# EAGLE board MSV-back (EAGLE 9.5.2)
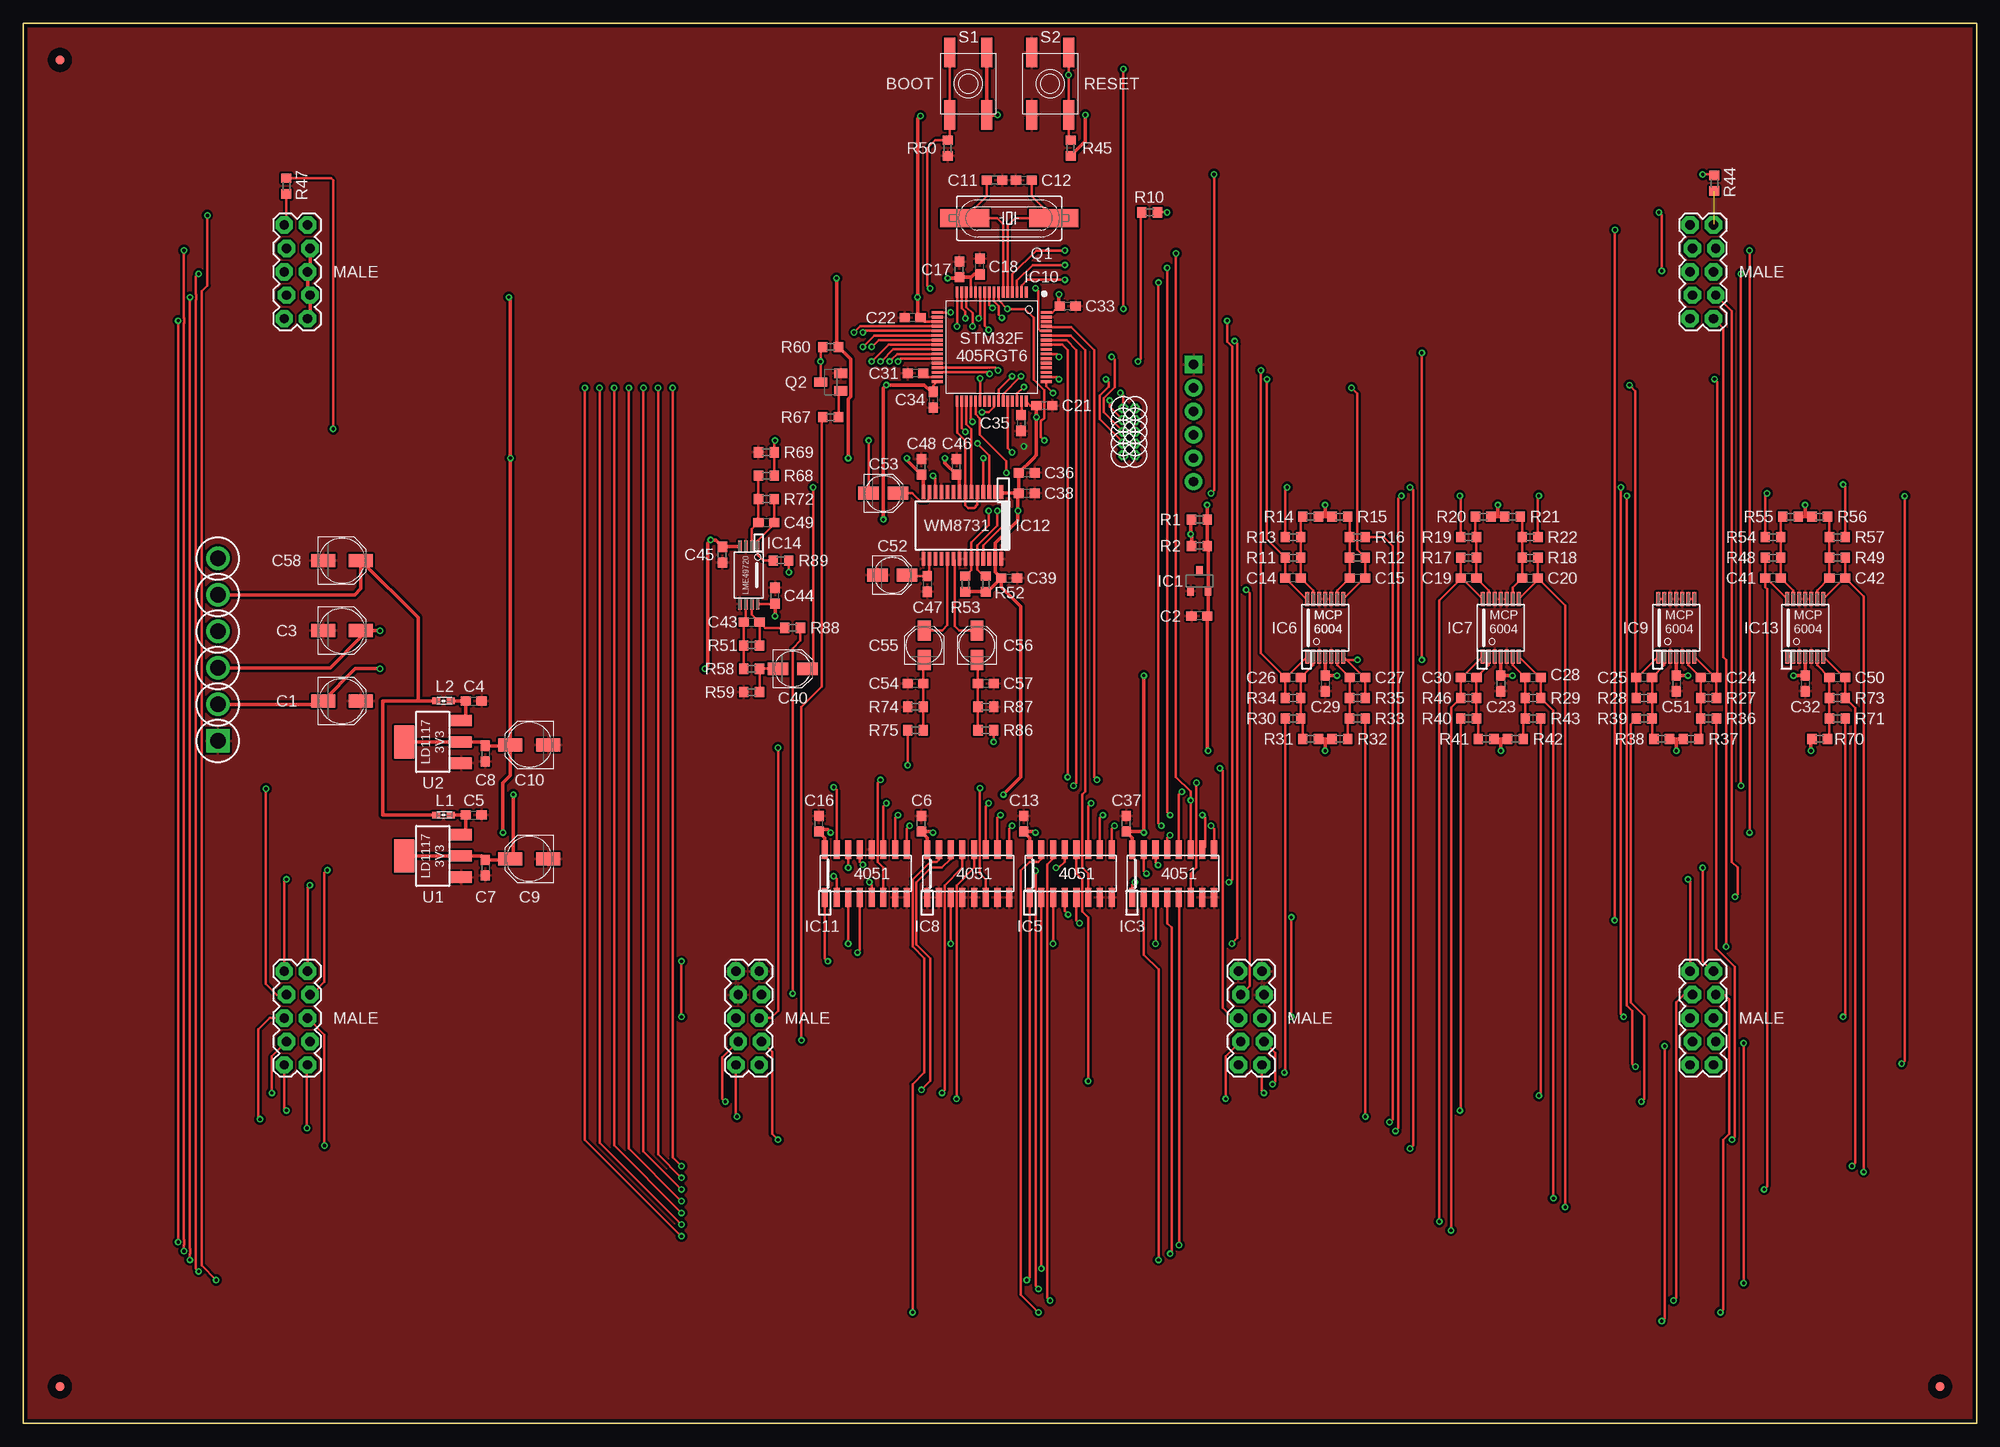
[diagram p5: board, top side]
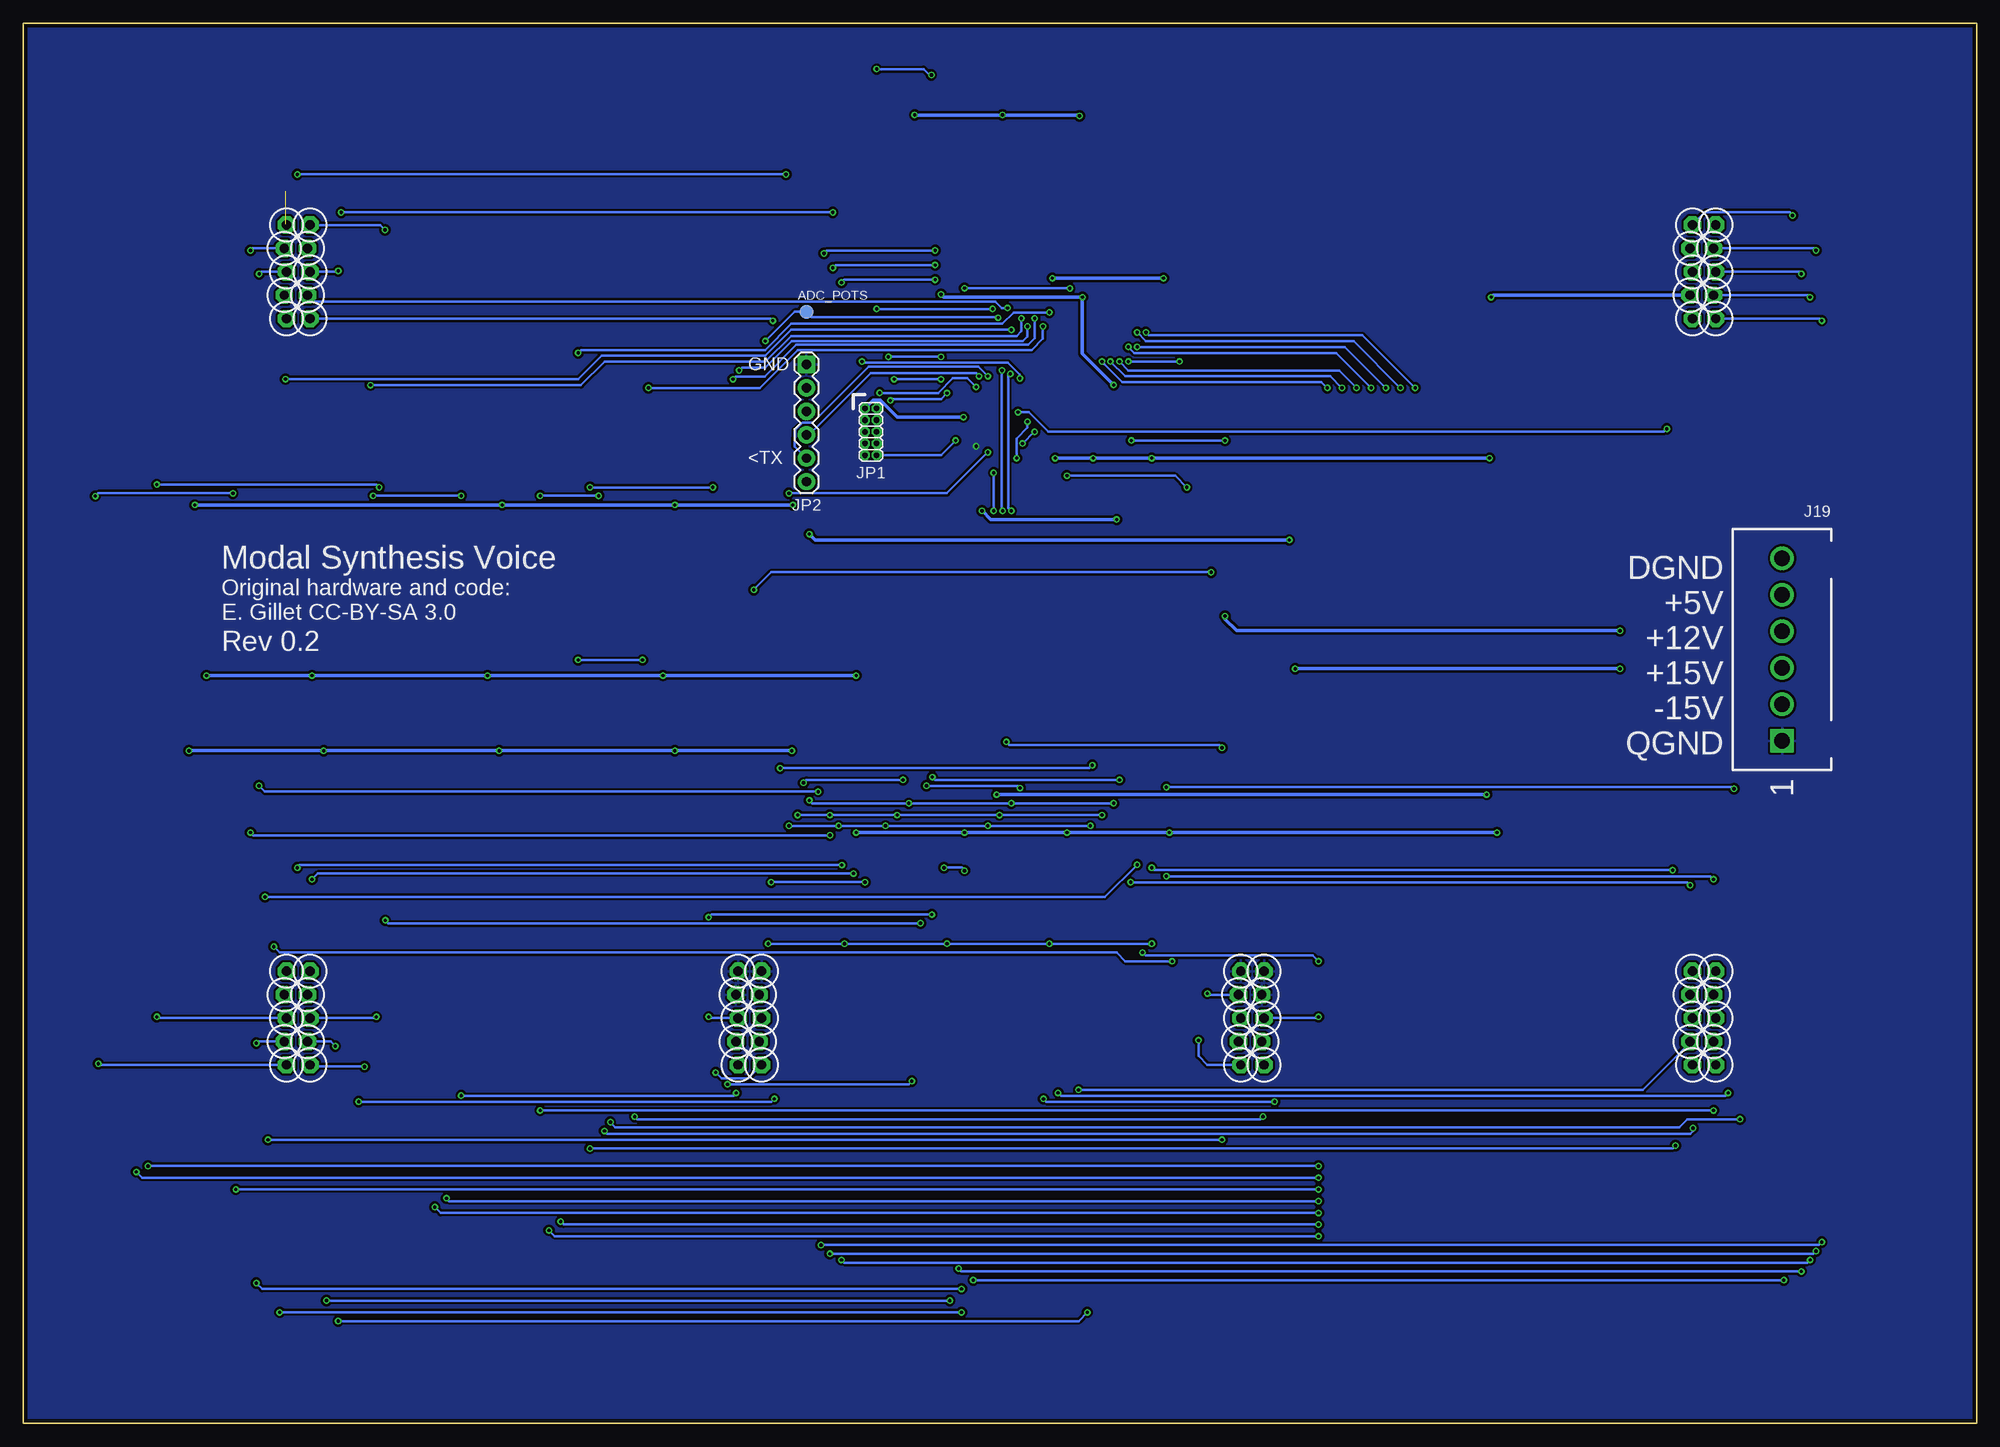
[diagram p6: board, bottom side, seen from below]

Size 212 x 152 mm. Coordinates in mm from the lower left corner, seen from the top.
Outline: 0,0 212,0 212,152 0,152 0,0
Copper layers (1*16): Top 0.0356mm / dielectric 1.5011mm / Bottom 0.0356mm
Design rules "ES_DRC_MaskedVias": minimum track width 6mil, minimum drill 13mil, track to track 6mil, track to pad 6mil, pad to pad 6mil, via to via 6mil, smd to smd 6mil, copper to edge 15mil, drill to drill 6mil, minimum pad ring 7mil, minimum via ring 7mil, stop-mask expansion 3mil, vias tented up to drill 16mil, thermal gap 10mil
Net classes: 0 default: width 0.203 mm

## Footprints (pad centres in the part's own frame; a part is rotated, then mirrored left to right if it is on the bottom)
PANASONIC_C = smd 2.6 x 1.4: + 2.05,0; - -2.05,0
C0603 = smd 1.1 x 1: 1 -0.85,0; 2 0.85,0
PANASONIC_B = smd 2.2 x 1.4: + 1.6,0; - -1.6,0
FIDUCIAL_1MM = smd 1 x 1: 1 0,0
DBZ_R-PDSO-G3 = smd 0.7 x 1: 1 -0.95,-1.1; 2 0.95,-1.1; 3 0,1.1
SO-16 = smd 0.66 x 2.032: 1 -4.445,-2.591; 2 -3.175,-2.591; 3 -1.905,-2.591; 4 -0.635,-2.591; 5 0.635,-2.591; 6 1.905,-2.591; 7 3.175,-2.591; 8 4.445,-2.591; 9 4.445,2.591; 10 3.175,2.591; 11 1.905,2.591; 12 0.635,2.591; 13 -0.635,2.591; 14 -1.905,2.591; 15 -3.175,2.591; 16 -4.445,2.591
TSSOP-14 = smd 0.45 x 1.5: 1 -1.95,-3.117; 2 -1.3,-3.117; 3 -0.65,-3.117; 4 0,-3.117; 5 0.65,-3.117; 6 1.3,-3.117; 7 1.95,-3.117; 8 1.95,3.117; 9 1.3,3.117; 10 0.65,3.117; 11 0,3.117; 12 -0.65,3.117; 13 -1.3,3.117; 14 -1.95,3.117
TQFP-10X10-64 = smd 1.2 x 0.3: 1 -5.936,3.75; 2 -5.936,3.25; 3 -5.936,2.75; 4 -5.936,2.25; 5 -5.936,1.75; 6 -5.936,1.25; 7 -5.936,0.75; 8 -5.936,0.25; 9 -5.936,-0.25; 10 -5.936,-0.75; 11 -5.936,-1.25; 12 -5.936,-1.75; 13 -5.936,-2.25; 14 -5.936,-2.75; 15 -5.936,-3.25; 16 -5.936,-3.75; 33 5.886,-3.75; 34 5.886,-3.25; 35 5.886,-2.75; 36 5.886,-2.25; 37 5.886,-1.75; 38 5.886,-1.25; 39 5.886,-0.75; 40 5.886,-0.25; 41 5.886,0.25; 42 5.886,0.75; 43 5.886,1.25; 44 5.886,1.75; 45 5.886,2.25; 46 5.886,2.75; 47 5.886,3.25; 48 5.886,3.75 | smd 0.3 x 1.2: 17 -3.75,-5.911; 18 -3.25,-5.911; 19 -2.75,-5.911; 20 -2.25,-5.911; 21 -1.75,-5.911; 22 -1.25,-5.911; 23 -0.75,-5.911; 24 -0.25,-5.911; 25 0.25,-5.911; 26 0.75,-5.911; 27 1.25,-5.911; 28 1.75,-5.911; 29 2.25,-5.911; 30 2.75,-5.911; 31 3.25,-5.911; 32 3.75,-5.911; 49 3.75,5.936; 50 3.25,5.936; 51 2.75,5.936; 52 2.25,5.936; 53 1.75,5.936; 54 1.25,5.936; 55 0.75,5.936; 56 0.25,5.936; 57 -0.25,5.936; 58 -0.75,5.936; 59 -1.25,5.936; 60 -1.75,5.936; 61 -2.25,5.936; 62 -2.75,5.936; 63 -3.25,5.936; 64 -3.75,5.936
SSOP-28 = smd 0.4 x 1.5: 1 -4.225,-3.625; 2 -3.575,-3.625; 3 -2.925,-3.625; 4 -2.275,-3.625; 5 -1.625,-3.625; 6 -0.975,-3.625; 7 -0.325,-3.625; 8 0.325,-3.625; 9 0.975,-3.625; 10 1.625,-3.625; 11 2.275,-3.625; 12 2.925,-3.625; 13 3.575,-3.625; 14 4.225,-3.625; 15 4.225,3.625; 16 3.575,3.625; 17 2.925,3.625; 18 2.275,3.625; 19 1.625,3.625; 20 0.975,3.625; 21 0.325,3.625; 22 -0.325,3.625; 23 -0.975,3.625; 24 -1.625,3.625; 25 -2.275,3.625; 26 -2.925,3.625; 27 -3.575,3.625; 28 -4.225,3.625
TSSOP-8 = smd 0.35 x 1.27: 1 -0.99,-3.117; 2 -0.34,-3.117; 3 0.31,-3.117; 4 0.96,-3.117; 5 0.96,3.117; 6 0.31,3.117; 7 -0.34,3.117; 8 -0.99,3.117
MTA_156 = drill 1.7 square: 1 -9.9,0 | drill 1.7: 2 -5.94,0; 3 -1.98,0; 4 1.98,0; 5 5.94,0; 6 9.9,0
2X5-1.27 = drill 0.61 pad 1.067 octagon: 1 -1.27,3.81; 2 0,3.81; 3 -1.27,2.54; 4 0,2.54; 5 -1.27,1.27; 6 0,1.27; 7 -1.27,0; 8 0,0; 9 -1.27,-1.27; 10 0,-1.27
1X06_SQUARE = drill 1.016 pad 1.88 square: 1 0,0 | drill 1.016 pad 1.88: 2 2.54,0; 3 5.08,0; 4 7.62,0; 5 10.16,0; 6 12.7,0
WUERTH-ELEKTRONIK_0603 = smd 0.85 x 0.7: 1 -0.9,0; 2 0.7,0
2X5_LOCK_MALE = drill 1.016 pad 1.88 octagon: 1 -1.397,5.08; 2 1.143,5.08; 3 -1.143,2.54; 4 1.397,2.54; 5 -1.397,0; 6 1.143,0; 7 -1.143,-2.54; 8 1.397,-2.54; 9 -1.397,-5.08; 10 1.143,-5.08
HC49UP = smd 5.334 x 1.93: 1 -4.826,0; 2 4.826,0
SOT23-BEC = smd 1 x 1.4: B -0.95,-1.1; C 0,1.1; E 0.95,-1.1
R0603 = smd 1 x 1.1: 1 -0.85,0; 2 0.85,0
EVQ-Q2 = smd 3.2 x 1.2: A -3.4,-2; A' 3.4,-2; B -3.4,2; B' 3.4,2
TP15R = smd 1.5 x 1.5: TP 0,0
SOT223 = smd 2.235 x 1.219: 1 3.099,-2.311; 2 3.099,0; 3 3.099,2.311 | smd 2.2 x 3.6: TAB -3.099,0

## Placement (x,y rotation side)
C1  22UF  [PANASONIC_C]  34.61,78.42 0 top
C2  100NF  [C0603]  127.64,87.63 180 top
C3  22UF  [PANASONIC_C]  34.61,86.04 0 top
C4  100NF  [C0603]  48.9,78.42 0 top
C5  100NF  [C0603]  48.9,66.04 0 top
C6  100NF  [C0603]  97.47,65.09 90 top
C7  100NF  [C0603]  50.16,60.33 270 top
C8  100NF  [C0603]  50.16,72.71 270 top
C9  22UF  [PANASONIC_C]  54.93,61.28 180 top
C10  22UF  [PANASONIC_C]  54.93,73.66 180 top
C11  18PF  [C0603]  105.41,134.94 180 top
C12  18PF  [C0603]  108.58,134.94 0 top
C13  100NF  [C0603]  108.58,65.09 90 top
C14  3.3NF  [C0603]  137.79,91.76 180 top
C15  3.3NF  [C0603]  144.78,91.76 0 top
C16  100NF  [C0603]  86.36,65.09 90 top
C17  1UF  [C0603]  101.6,125.25 90 top
C18  100NF  [C0603]  103.82,125.57 90 top
C19  3.3NF  [C0603]  156.84,91.76 180 top
C20  3.3NF  [C0603]  163.51,91.76 0 top
C21  100NF  [C0603]  110.81,110.49 0 top
C22  100NF  [C0603]  96.52,120.02 180 top
C23  100NF  [C0603]  160.34,80.33 270 top
C24  3.3NF  [C0603]  182.88,80.96 0 top
C25  3.3NF  [C0603]  175.9,80.96 180 top
C26  3.3NF  [C0603]  137.79,80.96 180 top
C27  3.3NF  [C0603]  144.78,80.96 0 top
C28  3.3NF  [C0603]  163.83,80.96 0 top
C29  100NF  [C0603]  141.29,80.33 270 top
C30  3.3NF  [C0603]  156.84,80.96 180 top
C31  2.2UF  [C0603]  96.84,113.98 180 top
C32  100NF  [C0603]  193.36,80.33 270 top
C33  100NF  [C0603]  113.35,121.28 0 top
C34  100NF  [C0603]  98.74,111.12 270 top
C35  2.2UF  [C0603]  108.27,108.58 270 top
C36  1UF  [C0603]  108.9,103.19 0 top
C37  100NF  [C0603]  119.7,65.09 90 top
C38  100NF  [C0603]  108.9,100.97 0 top
C39  100NF  [C0603]  107,91.76 0 top
C40  10UF  [PANASONIC_B]  83.5,81.92 0 top
C41  3.3NF  [C0603]  189.87,91.76 180 top
C42  3.3NF  [C0603]  196.85,91.76 0 top
C43  18PF  [C0603]  79.06,87 0 top
C44  100NF  [C0603]  81.6,89.85 90 top
C45  100NF  [C0603]  75.88,94.3 90 top
C46  100NF  [C0603]  101.28,103.82 90 top
C47  100NF  [C0603]  98.11,91.12 270 top
C48  1UF  [C0603]  97.47,103.82 90 top
C49  18PF  [C0603]  80.64,97.79 0 top
C50  3.3NF  [C0603]  196.85,80.96 0 top
C51  100NF  [C0603]  179.39,80.33 270 top
C52  10UF  [PANASONIC_B]  94.3,92.08 0 top
C53  10UF  [PANASONIC_B]  93.34,100.97 0 top
C54  220PF  [C0603]  96.84,80.33 180 top
C55  10UF  [PANASONIC_B]  97.79,84.45 90 top
C56  10UF  [PANASONIC_B]  103.5,84.45 90 top
C57  220PF  [C0603]  104.46,80.33 0 top
C58  22UF  [PANASONIC_C]  34.61,93.66 0 top
FD1  FIDUCIAL  [FIDUCIAL_1MM]  4,148 0 top
FD2  FIDUCIAL  [FIDUCIAL_1MM]  4,4 0 top
FD3  FIDUCIAL  [FIDUCIAL_1MM]  208,4 0 top
IC1  LM4040-10V  [DBZ_R-PDSO-G3]  127.64,91.44 0 top
IC3  4051D  [SO-16]  124.78,59.69 0 top
IC5  4051D  [SO-16]  113.67,59.69 0 top
IC6  MCP6004  [TSSOP-14]  141.29,86.36 0 top
IC7  MCP6004  [TSSOP-14]  160.34,86.36 0 top
IC8  4051D  [SO-16]  102.55,59.69 0 top
IC9  MCP6004  [TSSOP-14]  179.39,86.36 0 top
IC10  STM32F405RGT6  [TQFP-10X10-64]  105.09,116.84 270 top
IC11  4051D  [SO-16]  91.44,59.69 0 top
IC12  WM8731  [SSOP-28]  101.92,97.47 180 top
IC13  MCP6004  [TSSOP-14]  193.36,86.36 0 top
IC14  LME49720  [TSSOP-8]  78.74,92.08 180 top
J19  BU_PWR_NO_I2C  [MTA_156]  21.14,84 90 bottom
JP1  M05X2MINIJTAG  [2X5-1.27]  119.38,106.36 0 bottom
JP2  [1X06_SQUARE]  127,114.94 270 bottom
L1  FB R0603  [WUERTH-ELEKTRONIK_0603]  45.72,66.04 0 top
L2  FB R0603  [WUERTH-ELEKTRONIK_0603]  45.72,78.42 0 top
P1  M05X2_LOCK_MALE  [2X5_LOCK_MALE]  29.74,125 0 top
P2  M05X2_LOCK_MALE  [2X5_LOCK_MALE]  29.74,44 0 top
P3  M05X2_LOCK_MALE  [2X5_LOCK_MALE]  78.74,44 0 top
P4  M05X2_LOCK_MALE  [2X5_LOCK_MALE]  133.27,44 0 top
P5  M05X2_LOCK_MALE  [2X5_LOCK_MALE]  182.27,44 0 top
P6  M05X2_LOCK_MALE  [2X5_LOCK_MALE]  182.27,125 0 top
Q1  8MHz  [HC49UP]  107,130.81 0 top
Q2  MMBT3904  [SOT23-BEC]  87.63,113.03 90 top
R1  1K  [R0603]  127.64,98.11 0 top
R2  1K  [R0603]  127.64,95.25 0 top
R10  33K  [R0603]  122.24,131.44 0 top
R11  10K  [R0603]  137.79,93.98 0 top
R12  10K  [R0603]  144.78,93.98 180 top
R13  100K  [R0603]  137.79,96.2 180 top
R14  62K  [R0603]  139.7,98.42 0 top
R15  62K  [R0603]  142.88,98.42 180 top
R16  100K  [R0603]  144.78,96.2 0 top
R17  10K  [R0603]  156.84,93.98 0 top
R18  10K  [R0603]  163.51,93.98 180 top
R19  100K  [R0603]  156.84,96.2 180 top
R20  62K  [R0603]  158.43,98.42 0 top
R21  62K  [R0603]  161.61,98.42 180 top
R22  100K  [R0603]  163.51,96.2 0 top
R27  47K  [R0603]  182.88,78.74 180 top
R28  10K  [R0603]  175.9,78.74 0 top
R29  10K  [R0603]  163.83,78.74 180 top
R30  100K  [R0603]  137.79,76.52 180 top
R31  100K  [R0603]  139.7,74.3 0 top
R32  62K  [R0603]  142.88,74.3 180 top
R33  100K  [R0603]  144.78,76.52 0 top
R34  16K5  [R0603]  137.79,78.74 0 top
R35  10K  [R0603]  144.78,78.74 180 top
R36  100K  [R0603]  182.88,76.52 0 top
R37  180K  [R0603]  180.97,74.3 180 top
R38  62K  [R0603]  177.8,74.3 0 top
R39  100K  [R0603]  175.9,76.52 180 top
R40  100K  [R0603]  156.84,76.52 180 top
R41  62K  [R0603]  158.75,74.3 0 top
R42  62K  [R0603]  161.93,74.3 180 top
R43  100K  [R0603]  163.83,76.52 0 top
R44  1K  [R0603]  183.51,134.62 270 top
R45  10K  [R0603]  113.67,138.43 270 top
R46  10K  [R0603]  156.84,78.74 0 top
R47  1K  [R0603]  28.57,134.3 270 top
R48  10K  [R0603]  189.87,93.98 0 top
R49  10K  [R0603]  196.85,93.98 180 top
R50  10K  [R0603]  100.33,138.43 90 top
R51  47K  [R0603]  79.06,84.45 180 top
R52  2K2  [R0603]  104.46,91.12 270 top
R53  2K2  [R0603]  102.23,91.12 270 top
R54  100K  [R0603]  189.87,96.2 180 top
R55  62K  [R0603]  191.77,98.42 0 top
R56  62K  [R0603]  194.94,98.42 180 top
R57  100K  [R0603]  196.85,96.2 0 top
R58  16K  [R0603]  79.06,81.92 0 top
R59  47K  [R0603]  79.06,79.38 0 top
R60  10K  [R0603]  87.63,116.84 0 top
R67  100K  [R0603]  87.63,109.22 0 top
R68  16K  [R0603]  80.64,102.87 0 top
R69  47K  [R0603]  80.64,105.41 0 top
R70  62K  [R0603]  194.94,74.3 180 top
R71  100K  [R0603]  196.85,76.52 0 top
R72  47K  [R0603]  80.64,100.33 180 top
R73  10K  [R0603]  196.85,78.74 180 top
R74  16K  [R0603]  96.84,77.79 0 top
R75  36K  [R0603]  96.84,75.25 180 top
R86  36K  [R0603]  104.46,75.25 0 top
R87  16K  [R0603]  104.46,77.79 180 top
R88  1K  [R0603]  83.5,86.36 180 top
R89  1K  [R0603]  82.23,93.66 180 top
S1  EVQQ2  [EVQ-Q2]  102.55,145.41 270 top
S2  EVQQ2  [EVQ-Q2]  111.44,145.41 270 top
TP1  TPTP15R  [TP15R]  127,120.65 0 bottom
U1  LD1117-3V3  [SOT223]  44.45,61.59 0 top
U2  LD1117-3V3  [SOT223]  44.45,73.98 0 top

## Tracks (layer width: path | path; a pad name or v marks a point on that pad's centre or on a via)
+3V3_A  (via drill 0.35)
  Top 0.254: IC10.13 102.84,124.38 102.87,124.4
  Top 0.406: U2.TAB U2.2 49.74,73.98 C8.1 52.77,73.56 C10.+ | C10.+ v52.88,104.78 52.88,122.06 v52.7,122.24 | v88.27,124.3 88.27,119.38 88.27,117.06 R60.2 89.79,115.53 89.79,111.43 89.53,111.18 v89.53,104.78 | v100.33,124.3 101.5,124.3 C17.1 102.87,124.4 103.19,124.72 C18.1 | IC12.14 97.69,102.75 C48.1 95.89,104.56 v95.89,104.78 | IC12.8 101.59,102.66 C46.1 100.01,104.24 v100.01,104.78 | C10.+ 52.88,70.34 52.07,69.53 v52.07,64.14 | IC6.4 C29.1 v142.56,81.18 | IC7.4 C23.1 v161.61,81.18 | IC9.4 C51.1 v180.66,81.18 | IC13.4 C32.1 v192.09,81.18 | v121.6,81.18 v121.6,64.14 121.5,64.24 C37.1 119.7,64.19 120.33,63.55 IC3.16 | v87.63,64.14 87.31,64.45 86.58,64.45 C16.1 86.36,64.19 87,63.55 IC11.16 | v98.74,64.14 98.64,64.24 C6.1 97.47,64.19 98.11,63.55 IC8.16 | v109.86,64.14 109.75,64.24 C13.1 108.58,64.19 109.22,63.55 IC5.16 | P1.4 31.14,125.25 P1.6 30.88,122.71 P1.8 31.14,120.17 P1.10
  Bottom 0.406: v88.27,124.3 89.53,124.3 v100.33,124.3 | v100.01,104.78 v95.89,104.78 v89.53,104.78 v52.88,104.78 | v52.07,64.14 v87.63,64.14 v98.74,64.14 v109.86,64.14 v121.6,64.14 | v192.09,81.18 v180.66,81.18 v161.61,81.18 v142.56,81.18 v121.6,81.18 | v52.7,122.24 52.48,122.46 P1.8
+3V3_D  (via drill 0.35)
  Top 0.254: IC10.48 109.31,110.49 C21.1 | C34.1 98.74,112.65 IC10.32 | IC10.19 97.8,119.59 C22.1 | IC10.64 111.66,120.59 112.36,121.28 C33.1
  Top 0.406: U1.TAB U1.2 49.74,61.59 C7.1 52.77,61.17 C9.+ 53.2,61.59 v53.2,68.26 | R53.2 R52.2 104.66,90.27 C39.1 | C39.1 106.15,90.81 108.27,88.69 108.27,70.17 v106.36,68.26 | C39.1 105.49,92.41 IC12.27 105.49,95.57 107.95,98.03 v107.95,99.06 107.95,100.86 C38.1 | C38.1 C36.1 109.59,104.72 109.96,105.09 v109.96,109.22 C21.1 | C38.1 106.28,100.97 IC12.1 | C34.1 98.53,111.97 97.79,112.71 v93.66,112.71 93.34,112.39 v93.34,98.11 | C22.1 97.05,120.33 v97.05,122.24 97.05,141.6 v97.37,141.92 | v112.39,122.56 112.39,121.39 C33.1 | v115.25,142.01 115.25,139.17 R45.2 | S1.B S1.B' v105.73,142.01
  Bottom 0.406: v53.2,68.26 v106.36,68.26 | JP1.1 120.29,110.53 120.29,110.55 119.76,111.09 119,111.09 117.13,109.22 112.39,109.22 v109.96,109.22 | v112.39,122.56 112.08,122.24 v97.05,122.24 97.05,116.1 v93.66,112.71 | v97.37,141.92 97.46,142.01 v105.73,142.01 v115.25,142.01 | v107.95,99.06 107,98.11 v93.34,98.11
+5V
  Top 0.406: L2.1 42.86,78.42 | J19.5 35.97,89.94 36.66,90.63 C58.+ 42.86,87.46 42.86,78.42 | 42.86,78.42 39.05,78.42 39.05,66.04 L1.1
ADC_ADDR_0  (via drill 0.35)
  Top 0.254: v113.03,127.32 109.92,127.32 107.34,124.75 IC10.4 | v125.09,127 125.09,70.17 126.68,68.58 v126.68,67.63 IC3.11 | v93.66,67.31 93.34,66.99 IC11.11 | IC8.11 104.46,66.99 v104.78,67.31 | v115.89,67.31 115.57,66.99 IC5.11
  Bottom 0.254: v93.66,67.31 v104.78,67.31 v115.89,67.31 126.36,67.31 v126.68,67.63 | v113.03,127.32 124.78,127.32 v125.09,127
ADC_ADDR_1  (via drill 0.35)
  Top 0.254: IC10.3 107.84,124.03 109.54,125.73 v113.03,125.73 | v124.46,66.04 124.14,66.36 v124.14,125.41 | v94.93,66.04 94.61,65.72 IC11.10 | IC8.10 105.73,65.72 v106.05,66.04 | v117.16,66.04 116.84,65.72 IC5.10 | v127.95,66.04 128.27,65.72 128.27,62.6 IC3.10
  Bottom 0.254: v94.93,66.04 v106.05,66.04 v117.16,66.04 v124.46,66.04 v127.95,66.04 | v113.03,125.73 123.83,125.73 v124.14,125.41
ADC_ADDR_2  (via drill 0.35)
  Top 0.254: IC10.2 108.34,123.51 108.98,124.14 v113.03,124.14 | v123.51,64.87 123.19,65.19 v123.19,123.83 | v96.2,64.87 95.89,64.55 IC11.9 | IC8.9 107,64.55 v107.31,64.87 | v118.43,64.87 118.11,64.55 IC5.9 | v128.91,64.87 129.22,64.55 IC3.9
  Bottom 0.254: v96.2,64.87 v107.31,64.87 v118.43,64.87 v123.51,64.87 v128.91,64.87 | v113.03,124.14 122.87,124.14 v123.19,123.83
ADC_BANK_0  (via drill 0.35)
  Top 0.254: IC10.57 112.78,117.09 113.35,116.52 v113.35,70.17 | IC11.6 93.34,60.33 92.71,60.96 92.71,69.53 v93.03,69.85
  Bottom 0.254: v113.35,70.17 113.03,69.85 v93.03,69.85
ADC_BANK_1  (via drill 0.35)
  Top 0.254: IC10.58 113.23,117.59 114.3,116.52 114.3,69.53 v113.98,69.22 | IC8.6 104.46,59.05 103.82,59.69 v103.82,68.97
  Bottom 0.254: v103.82,68.97 104.07,69.22 v113.98,69.22
ADC_BANK_2
  Top 0.254: IC10.59 113.69,118.09 115.25,116.52 115.25,68.58 114.94,68.26 114.94,60.33 115.57,59.69 IC5.6
ADC_BANK_3  (via drill 0.35)
  Top 0.254: IC10.61 111.1,119.02 113.71,119.02 116.2,116.52 116.2,70.17 v116.52,69.85 | IC3.6 126.68,59.69 127.32,60.33 v127.32,69.53
  Bottom 0.254: v127.32,69.53 127,69.85 v116.52,69.85
ADC_BLOW_SHAPE  (via drill 0.35)
  Top 0.254: IC6.8 145.52,91.76 C15.2 R12.1 144.78,94.83 144.78,111.76 v144.15,112.39 | IC10.16 v101.34,119.06
  Bottom 0.254: v101.34,119.06 101.34,117.73 102.55,116.52 127.95,116.52 132.08,112.39 v144.15,112.39
ADC_BLOW_TIMBRE  (via drill 0.35)
  Top 0.254: IC6.7 143.61,82.87 | 143.61,82.87 145.52,80.96 C27.2 R35.1 | IC10.17 v100.65,120.59 | v151.76,116.2 v151.76,82.87 | v144.78,82.87 143.61,82.87
  Bottom 0.254: v100.65,120.59 104.52,120.59 105.75,119.36 128.63,119.36 131.47,116.52 151.45,116.52 v151.76,116.2 | v151.76,82.87 v144.78,82.87
ADC_BOW_TIMBRE  (via drill 0.35)
  Top 0.254: IC6.14 139.22,89.48 C14.2 R11.1 134.96,95.97 v134.96,113.35 | IC10.15 101.84,121.04 102.23,120.65 v102.23,119.93
  Bottom 0.254: v102.23,119.93 102.23,117.79 102.96,117.07 128.1,117.07 131.53,113.64 134.66,113.64 v134.96,113.35
ADC_BRIGHTNESS  (via drill 0.35)
  Top 0.254: IC13.8 197.59,91.76 C42.2 | C42.2 R49.1 | v94.02,115.25 94.28,115.5 94.28,115.53 94.84,116.09 IC10.26 | v68.9,112.39 68.9,29.21 v71.44,26.67 | v199.71,27.3 199.71,89.75 C42.2
  Bottom 0.254: v94.02,115.25 92.44,113.67 70.17,113.67 v68.9,112.39 | v71.44,26.67 199.07,26.67 v199.71,27.3
ADC_DAMPING  (via drill 0.35)
  Top 0.254: IC7.8 164.36,91.55 C20.2 | C20.2 R18.1 | IC10.22 92.37,118.09 v91.12,116.84 | v64.14,112.39 64.14,30.16 v71.44,22.86 | v167.32,23.5 167.32,88.8 C20.2
  Bottom 0.254: v91.12,116.84 88.27,116.84 | 88.27,116.84 68.58,116.84 v64.14,112.39 | v167.32,23.5 166.69,22.86 v71.44,22.86 | 88.27,116.84
ADC_FM  (via drill 0.35)
  Top 0.254: IC9.1 175.16,80.96 C25.2 | C25.2 R28.1 | IC10.11 103.84,120.09 v103.69,119.93 | v174.31,112.69 174.94,112.06 174.94,81.06 C25.2
  Bottom 0.254: v103.69,119.93 103.69,118.56 104.21,118.04 128.66,118.04 131.44,115.25 148.91,115.25 151.47,112.69 v174.31,112.69
ADC_GEOMETRY  (via drill 0.35)
  Top 0.254: IC7.7 164.57,80.96 C28.2 R29.1 166.05,77.37 v166.05,24.45 | IC10.23 92.83,117.59 v92.08,116.84 | v65.72,112.39 65.72,29.84 v71.44,24.13
  Bottom 0.254: v92.08,116.84 91.42,116.18 69.51,116.18 v65.72,112.39 | v71.44,24.13 165.74,24.13 v166.05,24.45
ADC_POSITION  (via drill 0.35)
  Top 0.254: IC13.14 189.13,91.76 C41.2 | C41.2 R48.1 | v93.03,115.25 93.09,115.25 94.43,116.59 IC10.25 | v67.31,112.39 67.31,29.53 v71.44,25.4 | v188.91,25.4 189.23,25.72 189.23,90.59 189.01,90.81 C41.2
  Bottom 0.254: v93.03,115.25 92.08,114.3 69.22,114.3 v67.31,112.39 | v71.44,25.4 v188.91,25.4
ADC_POTS  (via drill 0.35)
  Top 0.254: IC10.8 105.34,121.83 105.89,121.28 105.89,120.33 v106.2,120.02 | v131.15,52.07 131.76,52.68 131.76,117.18 v131.47,117.47 | IC3.3 v122.87,52.07 | v100.65,52.07 IC8.3 | v111.76,52.07 IC5.3 | v89.53,52.07 IC11.3
  Bottom 0.254: v106.2,120.02 106.27,120.08 126.43,120.08 TP1.TP 128.27,120.65 131.44,117.47 v131.47,117.47 | v131.15,52.07 v122.87,52.07 v111.76,52.07 v100.65,52.07 v89.53,52.07
ADC_PRESSURE  (via drill 0.35)
  Top 0.254: IC6.1 137.06,80.96 C26.2 | C26.2 R34.1 | v103.03,119.06 103.03,120.49 102.34,121.18 IC10.14 | v134.3,114.3 134.3,83.61 C26.2
  Bottom 0.254: v103.03,119.06 103.03,117.95 103.5,117.47 128.59,117.47 131.44,114.62 133.99,114.62 v134.3,114.3
ADC_SPACE  (via drill 0.35)
  Top 0.254: IC13.7 197.59,80.96 C50.2 R73.1 198.8,77.64 198.8,28.3 v198.44,27.94 | IC10.27 99.16,115.57 95.25,115.57 v94.93,115.25 | v70.48,112.39 70.48,28.89 v71.44,27.94
  Bottom 0.254: v94.93,115.25 94.68,115 94.68,114.98 92.73,113.03 71.12,113.03 v70.48,112.39 | v71.44,27.94 v198.44,27.94
ADC_STRIKE_SHAPE  (via drill 0.35)
  Top 0.254: IC7.1 156.11,80.96 C30.2 R46.1 154.94,77.69 v154.94,20.95 | IC10.20 90.83,119.09 v90.17,118.43 | v60.96,112.39 60.96,30.8 v71.44,20.32
  Bottom 0.254: v90.17,118.43 89.85,118.11 66.67,118.11 v60.96,112.39 | v71.44,20.32 154.31,20.32 v154.94,20.95
ADC_STRIKE_TIMBRE  (via drill 0.35)
  Top 0.254: IC7.14 156.11,91.76 | 156.11,91.76 C19.2 R17.1 | IC10.21 91.28,118.59 v91.12,118.43 | v62.55,112.39 62.55,30.48 v71.44,21.59 | v153.67,21.91 153.67,89.32 156.11,91.76
  Bottom 0.254: v91.12,118.43 90.17,117.47 67.63,117.47 v62.55,112.39 | v153.67,21.91 153.35,21.59 v71.44,21.59
ADC_V_OCT  (via drill 0.35)
  Top 0.254: IC9.7 183.62,80.96 C24.2 | C24.2 R27.1 | IC10.10 104.34,119.13 v104.78,118.7 | v183.51,113.35 183.83,113.03 183.83,81.06 C24.2
  Bottom 0.254: v104.78,118.7 128.63,118.7 131.44,115.89 149.22,115.89 151.76,113.35 v183.51,113.35
AREF_-10  (via drill 0.35)
  Top 0.406: v128.49,99.69 R1.2 R2.2 128.59,95.15 IC1.2 128.59,87.73 C2.1 128.49,73.13 v128.59,73.03 | R14.2 141.29,98.42 | 141.29,98.42 R15.2 | v141.29,99.69 141.29,98.42 | R31.2 141.29,74.3 | 141.29,74.3 R32.2 | v141.29,73.03 141.29,74.3 | R41.2 160.34,74.3 | 160.34,74.3 R42.2 | v160.34,73.03 160.34,74.3 | R38.2 179.39,74.3 | 179.39,74.3 R37.2 | v179.39,73.03 179.39,74.3 | v193.99,73.03 193.99,74.19 R70.2 | R21.2 160.02,98.42 | 160.02,98.42 R20.2 | v160.02,99.69 160.02,98.42 | R55.2 193.36,98.42 | 193.36,98.42 R56.2 | v193.36,99.69 193.36,98.42
  Bottom 0.406: v128.49,99.69 v141.29,99.69 v160.02,99.69 v193.36,99.69 | v128.59,73.03 130.81,73.03 v141.29,73.03 v160.34,73.03 v179.39,73.03 v193.99,73.03
B_ADC_BLOW_SHAPE  (via drill 0.35)
  Top 0.254: R16.2 147.64,96.2 148.59,95.25 148.59,33.02 v148.27,32.7 | v25.72,33.02 25.53,33.2 25.53,42.78 26.75,44 P2.5
  Bottom 0.254: v148.27,32.7 147.73,32.16 32.3,32.16 31.43,33.02 v25.72,33.02
B_ADC_BLOW_TIMBRE  (via drill 0.35)
  Top 0.254: R33.2 v145.63,33.31 | v77.47,33.31 77.34,33.44 P3.9
  Bottom 0.254: v145.63,33.31 145.34,33.02 77.77,33.02 v77.47,33.31
B_ADC_BOW_TIMBRE  (via drill 0.35)
  Top 0.254: R13.2 136.94,101.39 v137.16,101.6 | v150.5,101.6 150.81,101.28 150.81,30.16 v150.5,29.84 | v32.7,30.16 32.7,42.18 P2.6
  Bottom 0.254: v137.16,101.6 v150.5,101.6 | v32.7,30.16 33.02,29.84 v150.5,29.84
B_ADC_BRIGHTNESS  (via drill 0.35)
  Top 0.254: R57.2 197.7,101.7 v197.49,101.92 | v173.35,101.6 173.35,44.45 v173.67,44.13
  Bottom 0.254: v197.49,101.92 173.67,101.92 v173.35,101.6 | v173.67,44.13 173.81,44 P5.5
B_ADC_DAMPING  (via drill 0.35)
  Top 0.254: R22.2 164.36,100.59 v164.47,100.69 | v174.01,100.69 174.01,89.88 173.99,89.85 173.99,45.4 174.62,44.77 174.62,39.05 v174.94,38.73
  Bottom 0.254: v164.47,100.69 v174.01,100.69 | v174.94,38.73 180.68,38.73 P5.9
B_ADC_FM  (via drill 0.35)
  Top 0.254: R39.2 174.41,75.88 174.41,45.72 175.9,44.23 175.9,35.24 v175.58,34.92 | v130.49,35.24 130.49,39.83 P4.7
  Bottom 0.254: v175.58,34.92 130.81,34.92 v130.49,35.24
B_ADC_GEOMETRY  (via drill 0.35)
  Top 0.254: R43.2 164.68,35.8 v164.47,35.58 | v134.62,35.88 134.41,36.09 P4.10
  Bottom 0.254: v164.47,35.58 134.91,35.58 v134.62,35.88
B_ADC_POSITION  (via drill 0.35)
  Top 0.254: R54.2 189.01,100.75 v189.23,100.97 | v204.15,100.65 204.15,39.37 v203.84,39.05
  Bottom 0.254: v189.23,100.97 203.84,100.97 v204.15,100.65 | v203.84,39.05 203.7,38.92 P5.10
B_ADC_PRESSURE  (via drill 0.35)
  Top 0.254: v136.84,38.1 136.94,38.2 R30.2
  Bottom 0.254: v136.84,38.1 136.21,37.47 133.32,37.47 P4.9
B_ADC_SPACE  (via drill 0.35)
  Top 0.254: R71.2 197.7,44.35 v197.49,44.13
  Bottom 0.254: v197.49,44.13 197.35,44 P5.6
B_ADC_STRIKE_SHAPE  (via drill 0.35)
  Top 0.254: R40.2 156,34.08 v155.89,33.97 | v28.57,33.97 28.34,34.21 P2.9
  Bottom 0.254: v155.89,33.97 v28.57,33.97
B_ADC_STRIKE_TIMBRE  (via drill 0.35)
  Top 0.254: v30.8,32.07 30.8,38.84 P2.10 | R19.2 156,100.59 v155.89,100.69 | v149.54,100.69 149.22,100.38 149.22,32.07 v148.91,31.75
  Bottom 0.254: v148.91,31.75 148.59,31.43 31.11,31.43 30.8,31.75 v30.8,32.07 | v155.89,100.69 v149.54,100.69
B_ADC_V_OCT  (via drill 0.35)
  Top 0.254: R36.2 183.73,51.54 185.74,49.53 185.74,31.11 v185.42,30.8 | v81.92,30.8 81.28,31.43 81.28,40.31 P3.8
  Bottom 0.254: v185.42,30.8 v81.92,30.8
B_ATTEN_BLW-T  (via drill 0.35)
  Top 0.254: v76.2,34.92 75.88,35.24 75.88,39.75 P3.7 | IC8.12 103.19,60.33 101.28,58.42 v101.28,35.24
  Bottom 0.254: v101.28,35.24 100.97,34.92 v76.2,34.92
B_ATTEN_BOW-T  (via drill 0.35)
  Top 0.254: v33.02,60.05 32.7,59.73 32.7,47.94 31.3,46.54 P2.4 | IC11.14 v89.53,60.33
  Bottom 0.254: v89.53,60.33 89.26,60.05 v33.02,60.05
B_ATTEN_BRIGHT  (via drill 0.35)
  Top 0.254: v179.07,13.34 179.39,13.65 179.39,45.72 180.21,46.54 P5.3 | v111.44,13.34 111.12,13.65 111.12,60.69 111.76,61.33 IC5.14
  Bottom 0.254: v111.44,13.34 v179.07,13.34
B_ATTEN_DAMP  (via drill 0.35)
  Top 0.254: v96.52,12.06 96.52,36.83 97.79,38.1 97.79,50.48 96.52,51.75 96.52,59.05 98.42,60.96 99.16,60.96 99.38,61.17 IC8.15 | v177.8,11.11 178.12,11.43 v178.12,40.96
  Bottom 0.254: v96.52,12.06 97.47,11.11 v177.8,11.11 | v178.12,40.96 178.62,41.46 P5.7
B_ATTEN_FLOW  (via drill 0.35)
  Top 0.254: v87.95,69.06 88.27,68.74 IC11.15 | P2.3 27.52,46.54 26.35,47.71 v26.35,68.9
  Bottom 0.254: v26.35,68.9 26.51,69.06 v87.95,69.06
B_ATTEN_GEO  (via drill 0.35)
  Top 0.254: v135.57,36.81 135.89,37.12 135.89,40.23 P4.8 | IC5.12 114.3,59.69 114.94,59.05 114.94,55.56 115.57,54.93 v115.57,37.15
  Bottom 0.254: v135.57,36.81 135.55,36.83 115.89,36.83 v115.57,37.15
B_ATTEN_MALLET  (via drill 0.35)
  Top 0.254: v99.69,35.88 100.01,36.2 100.01,58.42 101.92,60.33 IC8.13 | v26.99,35.88 26.99,39.85 P2.7
  Bottom 0.254: v99.69,35.88 99.38,35.56 76.5,35.56 76.47,35.58 75.93,35.58 75.91,35.56 27.3,35.56 v26.99,35.88
B_ATTEN_POSI  (via drill 0.35)
  Top 0.254: v110.17,14.61 109.86,14.92 v109.86,60.01 | v186.69,15.24 v186.69,41.27 | v112.08,60.33 112.39,60.33 113.03,60.96 IC5.13
  Bottom 0.254: v186.69,15.24 186.06,14.61 v110.17,14.61 | v186.69,41.27 186.5,41.46 P5.8 | v109.86,60.01 110.17,60.33 v112.08,60.33
B_ATTEN_SPACE  (via drill 0.35)
  Top 0.254: v110.17,12.06 108.27,13.97 108.27,60.01 109.22,60.96 110.17,60.96 110.49,61.28 IC5.15 | v184.15,12.06 184.47,12.38 184.47,30.8 185.1,31.43 185.1,46.04 184.6,46.54 P5.4
  Bottom 0.254: v110.17,12.06 v184.15,12.06
B_ATTEN_STR-T  (via drill 0.35)
  Top 0.254: v97.47,36.22 98.42,37.17 98.42,50.48 96.93,51.98 96.93,58.74 98.51,60.33 99.69,60.33 100.65,61.28 IC8.14
  Bottom 0.254: P2.8 31.14,41.34 36.26,36.22 v97.47,36.22
B_BLOW  (via drill 0.35)
  Top 0.254: v125.41,19.37 125.47,19.43 125.47,57.04 IC3.5 | v16.83,19.68 v16.83,119.7
  Bottom 0.254: v125.41,19.37 17.14,19.37 v16.83,19.68 | v16.83,119.7 17.05,119.92 P1.9
B_BOW  (via drill 0.35)
  Top 0.254: v123.19,17.76 123.2,17.77 123.2,49.26 121.6,50.86 IC3.2 | v18.1,17.76 18.1,18.41 18.12,18.44 18.12,18.98 18.1,19 18.1,122.22 v18.12,122.24
  Bottom 0.254: v123.19,17.76 122.89,17.46 18.39,17.46 v18.1,17.76 | v18.12,122.24 18.34,122.46 P1.7
B_BRIGHTNESS  (via drill 0.35)
  Top 0.254: v187.32,64.14 v187.32,127.32 | v124.44,63.84 124.14,63.55 IC3.13
  Bottom 0.254: v187.32,127.32 187.1,127.54 P6.4 | v124.44,63.84 124.46,63.82 187.01,63.82 v187.32,64.14
B_COARSE  (via drill 0.35)
  Top 0.254: v137.6,54.93 v137.6,44.13 | v113.4,55.24 113.03,55.61 IC5.4
  Bottom 0.254: v113.4,55.24 137.28,55.24 v137.6,54.93 | v137.6,44.13 137.47,44 P4.6
B_CONTOUR  (via drill 0.35)
  Top 0.254: v130.83,58.74 130.88,58.74 131.17,59.03 131.17,116.88 130.65,117.4 v130.65,119.7 | v120.64,58.75 120.33,58.44 IC3.1
  Bottom 0.254: v120.64,58.75 v130.82,58.75 v130.83,58.74 | P6.9 130.87,119.92 v130.65,119.7
B_DAMPING  (via drill 0.35)
  Top 0.254: P6.10 184.47,118.86 184.47,83.19 184.78,82.87 v184.78,51.75 | v87.31,50.16 87,50.48 IC11.1
  Bottom 0.254: v184.78,51.75 184.15,51.12 93.34,51.12 92.39,50.16 v87.31,50.16
B_FINE  (via drill 0.35)
  Top 0.254: v180.66,59.05 180.87,58.84 P5.1 | v121.9,59.69 121.6,59.98 IC3.15
  Bottom 0.254: v121.9,59.69 180.02,59.69 v180.66,59.05
B_FLOW  (via drill 0.35)
  Top 0.254: v17.46,18.71 17.46,19.39 17.48,19.41 17.48,19.96 17.46,19.98 17.46,119.4 17.48,119.42 17.48,119.97 17.46,119.99 v17.46,127.32 | v124.46,18.41 124.62,18.57 124.62,53.82 124.14,54.29 IC3.4
  Bottom 0.254: v17.46,18.71 17.76,18.41 v124.46,18.41 | v17.46,127.32 17.68,127.54 P1.3
B_FM  (via drill 0.35)
  Top 0.254: v182.25,60.33 182.25,50.16 183.33,49.08 P5.2 | v123.17,60.62 122.87,60.91 IC3.14
  Bottom 0.254: v123.17,60.62 181.95,60.62 v182.25,60.33
B_GATE  (via drill 0.35)
  Top 0.254: R67.1 86.78,109.19 86.68,109.09 86.68,80.01 84.45,77.79 v84.45,41.59
  Bottom 0.254: P3.10 83.5,38.92 84.45,39.87 v84.45,41.59
B_GEOMETRY  (via drill 0.35)
  Top 0.254: v172.7,54.61 172.7,101.87 172.72,101.89 v172.72,129.54 | v114.62,54.29 114.3,54.61 IC5.5
  Bottom 0.254: v172.72,129.54 173.26,130.08 P6.1 | v172.7,54.61 172.38,54.29 v114.62,54.29
B_LED1
  Top 0.254: R47.2 28.57,130.31 P1.1
B_LED2  (1 unrouted)
  Top 0.254: 183.51,130.19 P6.2
B_LED_GATE  (via drill 0.35)
  Top 0.254: R10.2 v124.14,131.44 | v177.48,131.44 177.8,131.13 v177.8,125.09
  Bottom 0.254: P6.5 177.9,125 v177.8,125.09 | v177.48,131.44 v124.14,131.44
B_LIN  (via drill 0.35)
  Top 0.254: R86.2 v105.31,73.98 | v81.92,73.34 81.92,44.76 81.15,44 P3.6
  Bottom 0.254: v105.31,73.98 104.99,73.66 82.23,73.66 v81.92,73.34
B_LOUT  (via drill 0.35)
  Top 0.254: R88.1 84.35,84.99 83.5,84.14 v83.5,46.67
  Bottom 0.254: v83.5,46.67 83.37,46.54 P3.4
B_MALLET  (via drill 0.35)
  Top 0.254: v20.95,15.56 19.37,17.14 19.37,122.87 20,123.51 v20,131.13 | v108.9,15.56 109.22,15.88 IC5.1
  Bottom 0.254: v108.9,15.56 v20.95,15.56 | v20,131.13 20.32,131.44 29.52,131.44 P1.2
B_POSITION  (via drill 0.35)
  Top 0.254: v185.74,57.15 186.06,57.47 186.06,60.33 185.42,60.96 185.42,120.7 P6.8 | v91.12,60.64 90.81,60.96 IC11.13
  Bottom 0.254: v91.12,60.64 94.61,57.15 v185.74,57.15
B_RIN  (via drill 0.35)
  Top 0.254: R75.2 v95.99,71.44 | v129.86,71.12 130.18,70.8 130.18,45.09 131.26,44 P4.5
  Bottom 0.254: v95.99,71.44 96.31,71.12 v129.86,71.12
B_ROUT  (via drill 0.35)
  Top 0.254: R89.1 v83.08,92.39 | P4.3 133.09,47.51 133.09,90.11 v132.72,90.49
  Bottom 0.254: v132.72,90.49 130.81,92.39 v83.08,92.39
B_SPACE  (via drill 0.35)
  Top 0.254: v186.4,69.22 186.4,124.75 v186.37,124.78 | v125.73,68.58 125.41,68.26 IC3.12
  Bottom 0.254: v186.4,69.22 185.76,68.58 v125.73,68.58 | v186.37,124.78 186.15,125 P6.6
B_STRIKE  (via drill 0.35)
  Top 0.254: v19.05,16.51 18.73,16.83 18.73,17.46 18.75,17.48 18.75,18.03 18.73,18.05 18.73,121.92 18.78,121.97 18.78,122.51 18.73,122.56 18.73,124.46 v19.05,124.78 | v110.49,16.8 IC5.2
  Bottom 0.254: v110.49,16.8 110.19,16.51 v19.05,16.51 | v19.05,124.78 19.27,125 P1.5
B_SW_GATE  (via drill 0.35)
  Top 0.254: IC10.9 104.84,121.4 v105.18,121.06
  Bottom 0.254: v105.18,121.06 105.82,121.06 106.52,121.75 180.42,121.75 P6.7
B_TIMBRE_BLOW  (via drill 0.35)
  Top 0.254: v71.44,50.16 v71.44,44.13 | v90.53,51.12 90.81,51.39 IC11.4
  Bottom 0.254: v90.53,51.12 90.21,50.8 72.07,50.8 v71.44,50.16 | v71.44,44.13 71.57,44 P3.5
B_TIMBRE_BOW  (via drill 0.35)
  Top 0.254: v31.11,58.42 30.88,58.19 P2.2 | v91.81,58.74 92.08,58.48 IC11.5
  Bottom 0.254: v31.11,58.42 31.43,58.74 v91.81,58.74
B_TIMBRE_STRIKE  (via drill 0.35)
  Top 0.254: v28.57,59.05 28.34,58.82 P2.1 | v87.95,59.4 88.27,59.08 IC11.2
  Bottom 0.254: v87.95,59.4 28.91,59.4 v28.57,59.05
BOOT_FLASH  (via drill 0.35)
  Top 0.254: S1.A S1.A' 100.55,139.5 R50.2 98.96,139.28 98.11,138.43 98.11,123.51 v98.42,123.19 | v109.86,123.21 110.15,122.92 110.15,118.82 110.38,118.59 IC10.60
  Bottom 0.254: v98.42,123.19 98.45,123.21 v109.86,123.21
GATE  (via drill 0.35)
  Top 0.254: Q2.C v86.53,115.25 86.53,116.59 R60.1 | IC10.24 93.91,117.09 v92.08,115.25
  Bottom 0.254: v92.08,115.25 v86.53,115.25
GND  (via drill 0.35)
  other vias: 108.58,106.05
  pour Bottom (isolate 0.254): 0,152 0,0 212,0 212,152
  pour Top (isolate 0.254): 0,152 0,0 212,0 212,152
I2C_SCL  (via drill 0.35)
  Top 0.254: R52.1 104.24,91.97 103.54,92.67 IC12.24 103.54,95.29 105.7,97.45 v105.7,99.06 | v105.8,114.3 105.5,114.59 IC10.29
  Bottom 0.254: v105.8,114.3 105.8,99.15 v105.7,99.06
I2C_SDA  (via drill 0.35)
  Top 0.254: R53.1 102.89,92.63 IC12.23 102.89,95.61 104.78,97.5 v104.78,99.06 | v104.89,113.93 104.73,114.09 IC10.30
  Bottom 0.254: v104.78,99.06 105.05,99.33 105.09,99.38 105.09,113.73 v104.89,113.93
I2S_LRCK
  Top 0.254: IC10.33 101.34,107.57 102.24,106.67 IC12.7 102.24,99.69 102.56,99.38 103.19,99.38 103.54,99.73 IC12.5
I2S_MCK  (via drill 0.35)
  Top 0.254: IC10.37 103.34,109.54 103.82,109.06 103.82,107.31 106.68,104.46 v106.68,103.19 | IC12.25 104.19,95.31 106.68,97.79 v106.68,99.06
  Bottom 0.254: v106.68,103.19 v106.68,99.06
I2S_SCK  (via drill 0.35)
  Top 0.254: v102.23,107.63 101.84,108.03 IC10.34 | v103.55,106.36 104.84,105.07 IC12.3
  Bottom 0.254: v102.23,107.63 102.28,107.63 v103.55,106.36
I2S_SIN
  Top 0.254: IC12.6 102.89,107.93 102.34,108.48 IC10.35
I2S_SOUT  (via drill 0.35)
  Top 0.254: IC12.4 v104.19,104.78 | v103.02,108.73 102.84,108.91 IC10.36
  Bottom 0.254: v104.19,104.78 104.19,106.07 104.21,106.09 104.21,106.91 103.02,108.1 v103.02,108.73
JTCK  (via drill 0.35)
  Top 0.254: v111.76,111.84 111.03,112.57 IC10.49 | JP1.4 117.9,110.39 v117.9,111.02
  Bottom 0.254: v111.76,111.84 112.39,111.2 117.72,111.2 v117.9,111.02
JTDI  (via drill 0.35)
  Top 0.254: IC10.50 112.15,113.59 v112.39,113.35 | v117.47,113.35 117.79,113.03 117.79,112.52 116.83,111.56 116.83,108.99 119.38,106.45 JP1.8
  Bottom 0.254: v117.47,113.35 v112.39,113.35
JTDO  (via drill 0.35)
  Top 0.254: v112.39,115.77 112.49,115.77 112.17,116.09 IC10.55 | v118.11,115.77 118.43,115.45 118.43,112.48 117.24,111.29 117.24,109.77 JP1.6
  Bottom 0.254: v118.11,115.77 v112.39,115.77
JTMS  (via drill 0.35)
  Top 0.254: JP1.2 119.37,110.18 119.37,111.54 v119.05,111.86 | v108.58,112.49 107.84,111.75 IC10.46
  Bottom 0.254: v119.05,111.86 112.71,111.86 111.12,113.45 109.54,113.45 v108.58,112.49
LED_GATE  (via drill 0.35)
  Top 0.254: IC10.38 v103.84,113.43 | v120.97,115.25 121.28,115.57 121.28,131.34 R10.1
  Bottom 0.254: v103.84,113.43 103.84,113.82 105.14,115.11 120.83,115.11 v120.97,115.25
LIN
  Top 0.254: IC12.20 101.11,93.68 101.11,86.53 101.59,86.06 C56.+
LOUT  (via drill 0.35)
  Top 0.254: C40.+ 85.72,82.54 v85.72,101.6 | v98.74,102.87 98.99,102.62 IC12.12
  Bottom 0.254: v85.72,101.6 87,102.87 v98.74,102.87
N$2
  Top 0.254: IC6.9 142.59,90.42 C15.1 R12.2 R16.1 143.93,98.22 R15.1
N$5
  Top 0.254: IC6.13 139.99,90.42 C14.1 R11.2 R13.1 138.65,98.22 R14.1
N$7
  Top 0.254: C12.2 109.44,133.2 Q1.2 107.63,130.81 106.84,130.02 IC10.5
N$8
  Top 0.254: C11.2 104.56,133.2 Q1.1 105.73,130.81 106.34,130.19 IC10.6
N$9
  Top 0.254: IC7.13 159.04,90.42 C19.1 R17.2 R19.1 157.58,96.31 R20.1
N$11
  Top 0.254: IC9.6 180.69,82.31 C24.1 R27.2 R36.1 182.03,74.5 R37.1
N$13
  Top 0.254: IC10.47 108.34,109.51 C35.1
N$14
  Top 0.254: IC7.9 161.64,90.73 C20.1 R18.2 R22.1 162.66,98.22 R21.1
N$15
  Top 0.254: IC9.2 178.09,82.31 C25.1 R28.2 R39.1 176.75,74.5 R38.1
N$17
  Top 0.254: C52.+ 96,91.97 C47.1 98.34,92.21 IC12.16
N$18
  Top 0.254: R86.1 R87.2 C57.1 103.61,82.75 C56.-
N$19
  Top 0.254: IC10.31 98.08,113.59 C31.1
N$22
  Top 0.254: R75.1 R74.2 C54.1 97.69,82.75 C55.-
N$23
  Top 0.254: C40.- R58.2 R59.2
N$24
  Top 0.254: IC7.2 159.04,82.31 C30.1 R46.2 R40.1 157.9,76.31 R41.1
N$25
  Top 0.254: R58.1 R51.2 C43.1 78.43,87.22 IC14.6
N$27
  Top 0.254: IC6.6 142.59,82.31 C27.1 R35.2 R33.1 143.72,76.31 R32.1
N$28
  Top 0.254: C43.2 79.08,87.82 IC14.7 | R51.1 C43.2 | R88.2 80.54,86.36 C43.2
N$30
  Top 0.254: R56.1 196,98.22 R57.1 R49.2 C42.1 194.66,90.42 IC13.9
N$31  (via drill 0.35)
  Top 0.254: R68.2 R69.2 81.5,106.58 v81.6,106.68 | C53.- v91.75,106.68
  Bottom 0.254: v91.75,106.68 v81.6,106.68
N$32
  Top 0.254: R68.1 R72.2 C49.1 79.08,97.08 IC14.2
N$33
  Top 0.254: R72.1 C49.2 81.5,97.59 79.73,95.83 IC14.1 79.73,94.26 80.33,93.66 R89.2
N$35
  Top 0.254: IC13.6 194.66,82.31 C50.1 R73.2 R71.1 196,74.5 R70.1
N$37
  Top 0.254: IC7.6 161.64,82.31 C28.1 R29.2 R43.1 162.78,76.31 R42.1
N$40
  Top 0.254: R55.1 190.72,98.22 R54.1 R48.2 C41.1 192.06,90.42 IC13.13
N$42
  Top 0.254: IC6.2 139.99,82.31 C26.1 R34.2 R30.1 138.85,76.31 R31.1
N$44
  Top 0.254: IC13.2 IC13.1
N$54  (via drill 0.35)
  Top 0.254: IC10.44 106.84,105.88 v107.31,105.41 | v128.91,100.97 129.22,101.28 v129.22,135.57 | v182.25,135.57 183.41,135.57 R44.1
  Bottom 0.254: v128.91,100.97 111.76,100.97 v107.31,105.41 | v129.22,135.57 v182.25,135.57
N$56
  Top 0.254: IC9.14 IC9.13
N$61
  Top 0.406: L1.2 C5.1 48.05,64.4 U1.3
N$64
  Top 0.254: IC9.9 IC9.8
N$66
  Top 0.254: R67.2 88.48,111.83 Q2.B
N$79  (via drill 0.35)
  Top 0.254: v104.05,109.76 104.8,109.76 105.34,110.31 IC10.41 | R47.1 33.44,135.15 33.66,134.94 v33.66,107.95
  Bottom 0.254: v104.05,109.76 102.87,109.76 100.74,107.63 33.97,107.63 v33.66,107.95
N$80
  Top 0.406: L2.2 C4.1 48.05,76.78 U2.3
RESET  (via drill 0.35)
  Top 0.254: R45.1 113.44,139.5 S2.B' v113.44,146.37 S2.B | v110.81,106.68 110.44,107.05 110.44,108.77 110.79,109.12 110.79,112.17 109.65,113.31 109.65,120.02 108.7,120.97 v106.8,120.97 105.84,121.92 IC10.7 | v119.38,120.97 v119.38,147
  Bottom 0.254: JP1.10 112.39,105.09 v110.81,106.68 | v106.8,120.97 v119.38,120.97 | v119.38,147 114.3,147 113.67,146.37 v113.44,146.37
RIN
  Top 0.254: IC12.19 100.29,86.64 99.71,86.06 C55.+
ROUT
  Top 0.254: C53.+ 96.48,100.97 97.38,100.07 98.01,100.07 98.34,100.4 IC12.13
RX  (via drill 0.35)
  Top 0.254: IC10.43 106.34,111.74 v108.27,113.67
  Bottom 0.254: JP2.4 126.68,107.31 120.02,113.98 108.58,113.98 v108.27,113.67
TX  (via drill 0.35)
  Top 0.254: IC10.42 105.84,112.19 v107.31,113.67
  Bottom 0.254: v107.31,113.67 108.36,114.71 120.24,114.71 126.31,108.64 127.4,108.64 128.22,107.82 128.22,107.05 128.27,107 128.27,106.05 JP2.5
VCC  (via drill 0.35)
  Top 0.254: C44.1 81.55,88.96 IC14.8
  Top 0.406: v38.73,86.04 C3.+ 36.66,85.34 33.34,82.02 J19.3 | v81.6,87.63 C44.1
  Bottom 0.406: v38.73,86.04 80.33,86.04 81.6,87.31 v81.6,87.63
VEE  (via drill 0.35)
  Top 0.406: IC14.4 75.93,95.19 C45.2 75.14,95.89 v74.61,95.89 74.3,95.57 74.3,82.23 v73.98,81.92 | R1.1 126.68,98 v126.68,96.52 126.78,96.42 R2.1 | J19.2 32.2,78.06 C1.- 36.05,81.92 v38.73,81.92
  Bottom 0.406: v74.61,95.89 126.05,95.89 v126.68,96.52 | v38.73,81.92 v73.98,81.92

## Text on the board
tPlace: BOOT | RESET | STM32F / 405RGT6 | WM8731 | LME49720 | MCP / 6004 | MCP / 6004 | MCP / 6004 | MCP / 6004 | MCP / 6004 | LD1117 / 3V3 | LD1117 / 3V3 | 4051 | 4051 | 4051 | 4051
bPlace: ADC_POTS | GND | <TX | Modal Synthesis Voice | Original hardware and code: / E. Gillet CC-BY-SA 3.0 | Rev 0.2